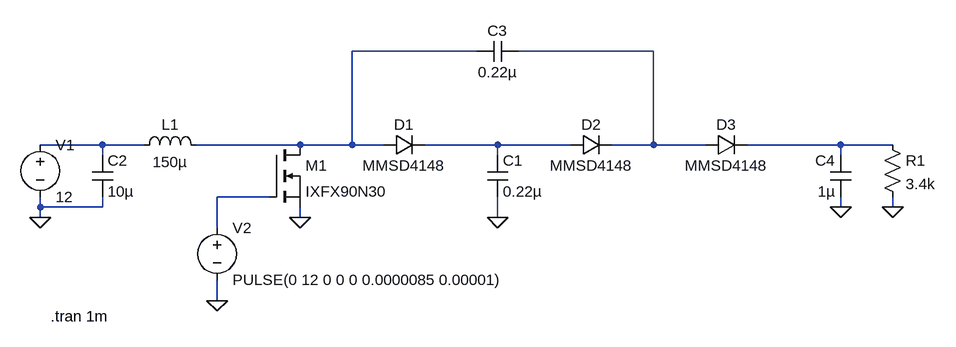
[diagram p0: schematic NixieBoost.asc]
NixieBoost.asc, the LTspice schematic file:
Version 4
SHEET 1 1240 680
WIRE 528 -144 336 -144
WIRE 800 -144 592 -144
WIRE -48 0 -144 0
WIRE 16 0 -48 0
WIRE 256 0 96 0
WIRE 336 0 336 -144
WIRE 336 0 256 0
WIRE 384 0 336 0
WIRE 560 0 448 0
WIRE 672 0 560 0
WIRE 800 0 800 -144
WIRE 800 0 736 0
WIRE 880 0 800 0
WIRE 1088 0 944 0
WIRE 1168 0 1088 0
WIRE -48 16 -48 0
WIRE 560 16 560 0
WIRE 1088 16 1088 0
WIRE 208 80 128 80
WIRE -144 96 -144 80
WIRE -48 96 -48 80
WIRE -48 96 -144 96
WIRE 1088 96 1088 80
WIRE 1168 96 1168 80
WIRE -144 112 -144 96
WIRE 256 112 256 96
WIRE 560 112 560 80
WIRE 128 128 128 80
WIRE 128 240 128 208
FLAG -144 112 0
FLAG 256 112 0
FLAG 128 240 0
FLAG 560 112 0
FLAG 1088 96 0
FLAG 1168 96 0
SYMBOL ind 0 16 R270
WINDOW 0 32 56 VTop 2
WINDOW 3 5 56 VBottom 2
SYMATTR InstName L1
SYMATTR Value 150µ
SYMBOL voltage -144 -16 R0
SYMATTR InstName V1
SYMATTR Value 12
SYMBOL nmos 208 0 R0
SYMATTR InstName M1
SYMATTR Value IXFX90N30
SYMBOL voltage 128 112 R0
WINDOW 123 0 0 Left 0
WINDOW 39 0 0 Left 0
SYMATTR InstName V2
SYMATTR Value PULSE(0 12 0 0 0 0.0000085 0.00001)
SYMBOL cap 544 16 R0
SYMATTR InstName C1
SYMATTR Value 0.22µ
SYMATTR SpiceLine Rser=10
SYMBOL diode 384 16 R270
WINDOW 0 32 32 VTop 2
WINDOW 3 0 32 VBottom 2
SYMATTR InstName D1
SYMATTR Value MMSD4148
SYMBOL cap -64 16 R0
SYMATTR InstName C2
SYMATTR Value 10µ
SYMBOL diode 672 16 R270
WINDOW 0 32 32 VTop 2
WINDOW 3 0 32 VBottom 2
SYMATTR InstName D2
SYMATTR Value MMSD4148
SYMBOL cap 592 -160 R90
WINDOW 0 0 32 VBottom 2
WINDOW 3 32 32 VTop 2
SYMATTR InstName C3
SYMATTR Value 0.22µ
SYMATTR SpiceLine Rser=10
SYMBOL cap 1104 80 R180
WINDOW 0 24 56 Left 2
WINDOW 3 24 8 Left 2
SYMATTR InstName C4
SYMATTR Value 1µ
SYMBOL diode 880 16 R270
WINDOW 0 32 32 VTop 2
WINDOW 3 0 32 VBottom 2
SYMATTR InstName D3
SYMATTR Value MMSD4148
SYMBOL res 1152 -16 R0
SYMATTR InstName R1
SYMATTR Value 3.4k
TEXT -128 264 Left 2 !.tran 1m

The netlist it stands for:
* NixieBoost.asc
L1 N003 N001 150µ
V1 N003 0 12
M1 N001 N006 0 0 IXFX90N30
V2 N006 0 PULSE(0 12 0 0 0 0.0000085 0.00001)
C1 N004 0 0.22µ Rser=10
D1 N001 N004 MMSD4148
C2 N003 0 10µ
D2 N004 N002 MMSD4148
C3 N002 N001 0.22µ Rser=10
C4 0 N005 1µ
D3 N002 N005 MMSD4148
R1 N005 0 3.4k
.model D D
.lib standard.dio
.model NMOS NMOS
.model PMOS PMOS
.lib standard.mos
.tran 1m
.backanno
.end